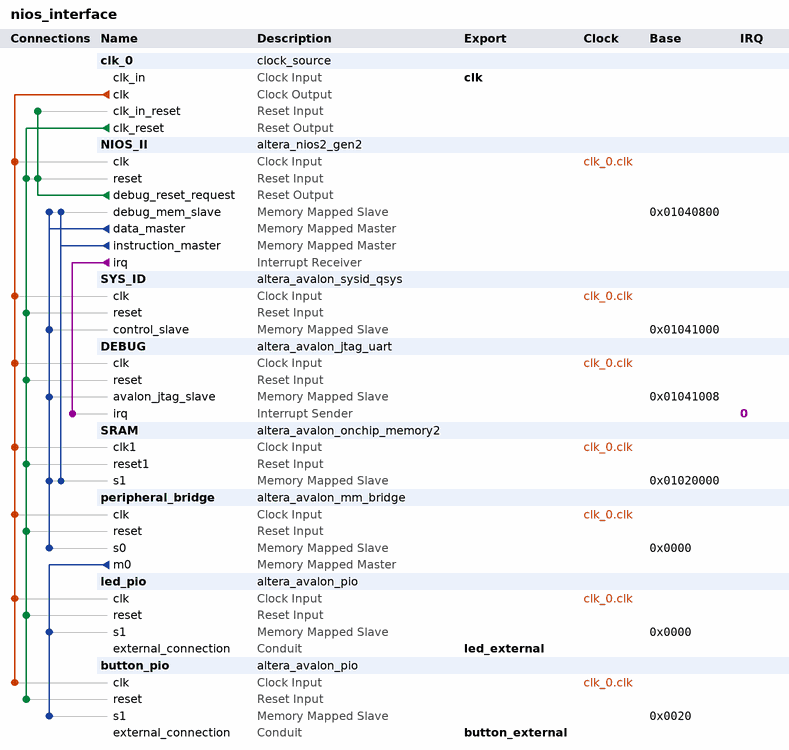
[diagram p0: system contents]
# Platform Designer (Qsys) system nios_interface, MAX 10 10M50DAF484C7G
# Parameters at their usual value, and those the tool derives, are not listed.
package require -exact qsys 18.1
create_system nios_interface
set_project_property DEVICE_FAMILY {MAX 10}
set_project_property DEVICE 10M50DAF484C7G

add_instance clk_0 clock_source 18.1
set_instance_parameter_value clk_0 clockFrequency 50000000

add_instance NIOS_II altera_nios2_gen2 18.1
set_instance_parameter_value NIOS_II dcache_size 2048
set_instance_parameter_value NIOS_II exceptionSlave SRAM.s1
set_instance_parameter_value NIOS_II icache_size 4096
set_instance_parameter_value NIOS_II impl Fast
set_instance_parameter_value NIOS_II resetSlave SRAM.s1

add_instance SYS_ID altera_avalon_sysid_qsys 18.1
set_instance_parameter_value SYS_ID id 0

add_instance DEBUG altera_avalon_jtag_uart 18.1
set_instance_parameter_value DEBUG simInteractiveOptions NO_INTERACTIVE_WINDOWS

add_instance SRAM altera_avalon_onchip_memory2 18.1
set_instance_parameter_value SRAM dataWidth 32
set_instance_parameter_value SRAM dualPort false
set_instance_parameter_value SRAM initMemContent false
set_instance_parameter_value SRAM initializationFileName onchip_mem.hex
set_instance_parameter_value SRAM memorySize 131072

add_instance peripheral_bridge altera_avalon_mm_bridge 18.1
set_instance_parameter_value peripheral_bridge ADDRESS_UNITS SYMBOLS
set_instance_parameter_value peripheral_bridge ADDRESS_WIDTH 10
set_instance_parameter_value peripheral_bridge DATA_WIDTH 32
set_instance_parameter_value peripheral_bridge MAX_PENDING_RESPONSES 4
set_instance_parameter_value peripheral_bridge USE_AUTO_ADDRESS_WIDTH 0

add_instance led_pio altera_avalon_pio 18.1
set_instance_parameter_value led_pio bitModifyingOutReg true
set_instance_parameter_value led_pio direction Output
set_instance_parameter_value led_pio width 1

add_instance button_pio altera_avalon_pio 18.1
set_instance_parameter_value button_pio direction Input
set_instance_parameter_value button_pio width 1

# connections
add_connection clk_0.clk button_pio.clk clock
add_connection clk_0.clk DEBUG.clk clock
add_connection clk_0.clk led_pio.clk clock
add_connection clk_0.clk NIOS_II.clk clock
add_connection clk_0.clk peripheral_bridge.clk clock
add_connection clk_0.clk SRAM.clk1 clock
add_connection clk_0.clk SYS_ID.clk clock
add_connection clk_0.clk_reset button_pio.reset reset
add_connection clk_0.clk_reset DEBUG.reset reset
add_connection clk_0.clk_reset led_pio.reset reset
add_connection clk_0.clk_reset NIOS_II.reset reset
add_connection clk_0.clk_reset peripheral_bridge.reset reset
add_connection clk_0.clk_reset SRAM.reset1 reset
add_connection clk_0.clk_reset SYS_ID.reset reset
add_connection NIOS_II.debug_reset_request clk_0.clk_in_reset reset
add_connection NIOS_II.debug_reset_request NIOS_II.reset reset
add_connection NIOS_II.data_master DEBUG.avalon_jtag_slave avalon
set_connection_parameter_value NIOS_II.data_master/DEBUG.avalon_jtag_slave baseAddress 0x01041008
add_connection NIOS_II.data_master NIOS_II.debug_mem_slave avalon
set_connection_parameter_value NIOS_II.data_master/NIOS_II.debug_mem_slave baseAddress 0x01040800
add_connection NIOS_II.data_master peripheral_bridge.s0 avalon
set_connection_parameter_value NIOS_II.data_master/peripheral_bridge.s0 baseAddress 0x0000
add_connection NIOS_II.data_master SRAM.s1 avalon
set_connection_parameter_value NIOS_II.data_master/SRAM.s1 baseAddress 0x01020000
add_connection NIOS_II.data_master SYS_ID.control_slave avalon
set_connection_parameter_value NIOS_II.data_master/SYS_ID.control_slave baseAddress 0x01041000
add_connection NIOS_II.instruction_master NIOS_II.debug_mem_slave avalon
set_connection_parameter_value NIOS_II.instruction_master/NIOS_II.debug_mem_slave baseAddress 0x01040800
add_connection NIOS_II.instruction_master SRAM.s1 avalon
set_connection_parameter_value NIOS_II.instruction_master/SRAM.s1 baseAddress 0x01020000
add_connection peripheral_bridge.m0 button_pio.s1 avalon
set_connection_parameter_value peripheral_bridge.m0/button_pio.s1 baseAddress 0x0020
add_connection peripheral_bridge.m0 led_pio.s1 avalon
set_connection_parameter_value peripheral_bridge.m0/led_pio.s1 baseAddress 0x0000
add_connection NIOS_II.irq DEBUG.irq interrupt
set_connection_parameter_value NIOS_II.irq/DEBUG.irq irqNumber 0

# exported interfaces
add_interface button_external conduit end
set_interface_property button_external EXPORT_OF button_pio.external_connection
add_interface clk clock sink
set_interface_property clk EXPORT_OF clk_0.clk_in
add_interface led_external conduit end
set_interface_property led_external EXPORT_OF led_pio.external_connection

set_interconnect_requirement {$system} qsys_mm.clockCrossingAdapter HANDSHAKE
set_interconnect_requirement {$system} qsys_mm.enableEccProtection FALSE
set_interconnect_requirement {$system} qsys_mm.insertDefaultSlave FALSE
set_interconnect_requirement {$system} qsys_mm.maxAdditionalLatency 1

save_system nios_interface.qsys
